# Altium schematic sheet HIGHSPEED_v0_SF2-COMM.SchDoc
size A3
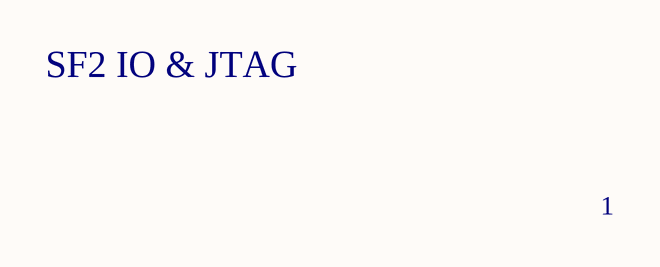
[diagram p0: HIGHSPEED_v0_SF2-COMM.SchDoc]

## Notes on the sheet
- SF2 IO & JTAG
- 1